# Altium project 210120_pcbVer2.PrjPCB
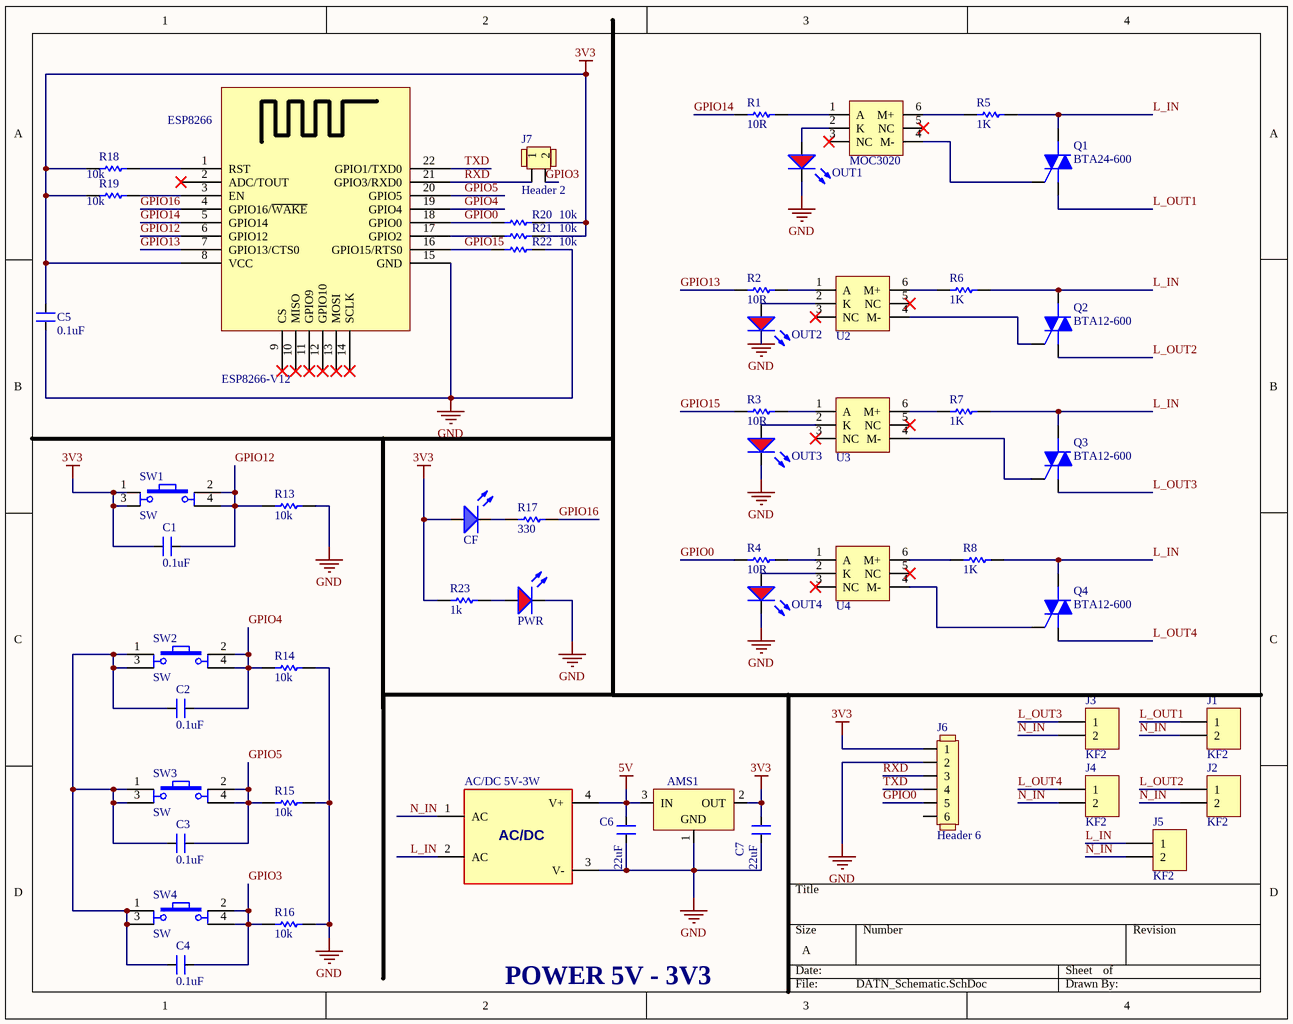
[diagram p0: DATN_Schematic.SchDoc]
1 sheet, 54 parts. Net scope: global (net labels, ports and power ports of the same name join across sheets).
Board file: 210120_pcbVer2.PcbDoc

## Sheet DATN_Schematic.SchDoc
size A

### Parts
AC/DC_5V-3W  5V3W-HLK-PM01  [HLK_PM01 5V3W]  (value not drawn)
AMS1  AMS1117-3V3  [AMS1117]  (value not drawn)
C1  0.1uF  [Cap 0805(2012)]
C2  0.1uF  [Cap 0805(2012)]
C3  0.1uF  [Cap 0805(2012)]
C4  0.1uF  [Cap 0805(2012)]
C5  0.1uF  [Cap 0805(2012)]
C6  22uF  [Cap 0805(2012)]
C7  22uF  [Cap 0805(2012)]
CF  LED_BLUE  [LED0805BLUE]  (value not drawn)
ESP8266  ESP8266-V12  [ESP-8266 V12]
J1  KF2  [KF2-5.08]
J2  KF2  [KF2-5.08]
J3  KF2  [KF2-5.08]
J4  KF2  [KF2-5.08]
J5  KF2  [KF2-5.08]
J6  Header 6  [HEADER x6]
J7  Header 2  [HEADER x2]
MOC3020  MOC3021M  [DIP6]  (value not drawn)
OUT1  LED_RED  [LED0805RED]  (value not drawn)
OUT2  LED_RED  [LED0805RED]  (value not drawn)
OUT3  LED_RED  [LED0805RED]  (value not drawn)
OUT4  LED_RED  [LED0805RED]  (value not drawn)
PWR  LED_RED  [LED0805RED]  (value not drawn)
Q1  BTA24-600  [TO220H1]
Q2  BTA12-600  [TO220H1]
Q3  BTA12-600  [TO220H1]
Q4  BTA12-600  [TO220H1]
R1  10R  [Res 0805(2012)]
R2  10R  [Res 0805(2012)]
R3  10R  [Res 0805(2012)]
R4  10R  [Res 0805(2012)]
R5  1K  [Res 0805(2012)]
R6  1K  [Res 0805(2012)]
R7  1K  [Res 0805(2012)]
R8  1K  [Res 0805(2012)]
R13  10k  [Res 0805(2012)]
R14  10k  [Res 0805(2012)]
R15  10k  [Res 0805(2012)]
R16  10k  [Res 0805(2012)]
R17  330  [Res 0805(2012)]
R18  10k  [Res 0805(2012)]
R19  10k  [Res 0805(2012)]
R20  10k  [Res 0805(2012)]
R21  10k  [Res 0805(2012)]
R22  10k  [Res 0805(2012)]
R23  1k  [Res 0805(2012)]
SW1  SW  [SWITCH 12X12]
SW2  SW  [SWITCH 12X12]
SW3  SW  [SWITCH 12X12]
SW4  SW  [SWITCH 12X12]
U2  MOC3021M  [DIP6]  (value not drawn)
U3  MOC3021M  [DIP6]  (value not drawn)
U4  MOC3021M  [DIP6]  (value not drawn)

### Nets
3V3: AMS1.2(OUT) C1.1 C5.2 C7.2 CF.1(A) ESP8266.8(VCC) J6.1 R18.2 R19.2 R20.1 R21.1 R23.2 SW1.1 SW1.3
5V: AC/DC_5V-3W.4(V+) AMS1.3(IN) C6.2
GND: AC/DC_5V-3W.3(V-) AMS1.1(GND) C5.1 C6.1 C7.1 ESP8266.15(GND) J6.2 OUT1.2(K) OUT2.2(K) OUT3.2(K) OUT4.2(K) PWR.2(K) R13.1 R14.1 R15.1 R16.1 R22.1
GPIO0: ESP8266.18(GPIO0) J6.5 R4.2 R20.2
GPIO3: C4.2 J7.2 R16.2 SW4.2 SW4.4
GPIO4: C2.2 ESP8266.19(GPIO4) R14.2 SW2.2 SW2.4
GPIO5: C3.2 ESP8266.20(GPIO5) R15.2 SW3.2 SW3.4
GPIO12: C1.2 ESP8266.6(GPIO12) R13.2 SW1.2 SW1.4
GPIO13: ESP8266.7(GPIO13/CTS0) R2.2
GPIO14: ESP8266.5(GPIO14) R1.2
GPIO15: ESP8266.16(GPIO15/RTS0) R3.2 R22.2
GPIO16: ESP8266.4(GPIO16/~{WAKE}) R17.1
L_IN: AC/DC_5V-3W.2(AC) J5.1 Q1.2(M2) Q2.2(M2) Q3.2(M2) Q4.2(M2) R5.1 R6.1 R7.1 R8.1
L_OUT1: J1.1 Q1.1(M1)
L_OUT2: J2.1 Q2.1(M1)
L_OUT3: J3.1 Q3.1(M1)
L_OUT4: J4.1 Q4.1(M1)
N_IN: AC/DC_5V-3W.1(AC) J1.2 J2.2 J3.2 J4.2 J5.2
RXD: ESP8266.21(GPIO3/RXD0) J6.3 J7.1
TXD: ESP8266.22(GPIO1/TXD0) J6.4
NetC2_1: C2.1 C3.1 C4.1 SW2.1 SW2.3 SW3.1 SW3.3 SW4.1 SW4.3
NetCF_2: CF.2(K) R17.2
NetESP8266_1: ESP8266.1(RST) R18.1
NetESP8266_3: ESP8266.3(EN) R19.1
NetESP8266_17: ESP8266.17(GPIO2) R21.2
NetMOC3020_1: MOC3020.1(A) R1.1
NetMOC3020_2: MOC3020.2(K) OUT1.1(A)
NetMOC3020_4: MOC3020.4(M-) Q1.3(G)
NetMOC3020_6: MOC3020.6(M+) R5.2
NetOUT2_1: OUT2.1(A) U2.2(K)
NetOUT3_1: OUT3.1(A) U3.2(K)
NetOUT4_1: OUT4.1(A) U4.2(K)
NetPWR_1: PWR.1(A) R23.1
NetQ2_3: Q2.3(G) U2.4(M-)
NetQ3_3: Q3.3(G) U3.4(M-)
NetQ4_3: Q4.3(G) U4.4(M-)
NetR2_1: R2.1 U2.1(A)
NetR3_1: R3.1 U3.1(A)
NetR4_1: R4.1 U4.1(A)
NetR6_2: R6.2 U2.6(M+)
NetR7_2: R7.2 U3.6(M+)
NetR8_2: R8.2 U4.6(M+)

Not connected (* = marked no-connect by the designer): AMS1 4(OUT); ESP8266 2(ADC/TOUT)* 9(CS)* 10(MISO)* 11(GPIO9)* 12(GPIO10)* 13(MOSI)* 14(SCLK)*; J6 6; MOC3020 3(NC)* 5(NC)*; U2 3(NC)* 5(NC)*; U3 3(NC)* 5(NC)*; U4 3(NC)* 5(NC)*

### Notes on the sheet
- POWER 5V - 3V3
- (in symbol 5V3W-HLK-PM01) AC/DC

### Library data of the parts
AMS1 = AMS1117-3V3: Linear Voltage Regulator 3.3V 1A 15V Max SOT-223; ComponentLink1Description: Datasheet; ComponentLink1URL: D:\Dropbox\Datasheets\Power Management ICs\Linear Regulators\AMS1117.pdf; Unit Price: 0.2000
C1-C7 = CAP_CER_0.1uF_50V_NPOL_1: Ceramic Capacitor 1nF/50V (+-20% TH)/(+10%SMD)
CF = LED_BLUE: LED Blue; ComponentLink1Description: Datasheet; ComponentLink1URL: D:\Dropbox\Datasheets\Opto and Illumination\LEDs\SMD LED.pdf; Unit Price: 0.0476; Value: Blue
J1-J5 = KF2: Manufacturer: Würth Elektronik eiSos GmbH; partNo: 691103110002; ComponentLink1 Description: Manufacturer; ComponentLink2 Description: Datasheet; NoPins: 2; Created Date: 29 October 2013; ComponentLink1URL: http://www.we-online.com; ComponentLink2URL: http://katalog.we-online.de/em/datasheet/6911031100xx.pdf; Created by: Karrer Zheng
OUT1-OUT4 PWR = LED_RED: LED Red; ComponentLink1Description: Datasheet; ComponentLink1URL: D:\Dropbox\Datasheets\Opto and Illumination\LEDs\SMD LED.pdf; Unit Price: 0.0476; Value: Red
Q1-Q4 = BTA12-600: Silicon Bidirectional Triode Thyristor; Note: Pin 2 is electrically connected to Pin 4 (TAB); Published: 29-Sep-2000; LatestRevisionDate: 17-Jul-2002; LatestRevisionNote: Re-released for DXP Platform.; DatasheetDocument: 1999; PackageReference: 369-03; Publisher: Altium Limited; Code_JEDEC: TO-251-AA; ComponentLink1Description: Manufacturer Link; ComponentLink1URL: http://www.motorola.com/
R1-R8 R13-R23 = Resistor 0805
SW1-SW4 = SW4: Switch button 4 pin; Value: Button chip 4 pin